# Altium project Clock_Led_7_thanh_Huynh_Tan_Cuong.PrjPcb
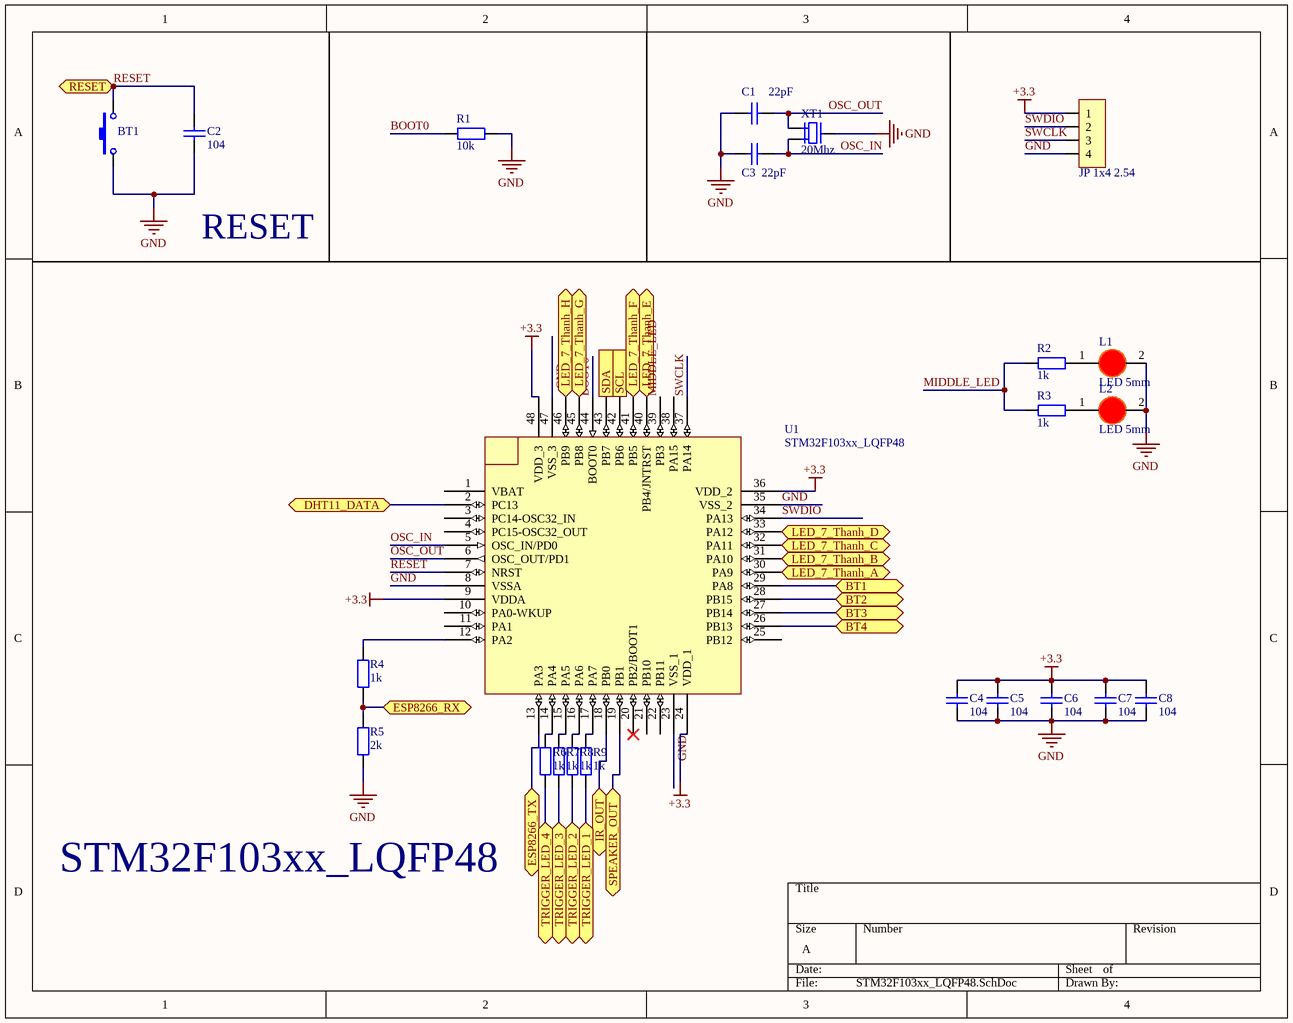
[diagram p0: STM32F103xx_LQFP48.SchDoc]
9 sheets, 77 parts. Net scope: flat (ports and power ports of the same name join across sheets).
Board file: PCB1.PcbDoc
Sheets:
  STM32F103xx_LQFP48.SchDoc
  4_LEDS_SEGMENT.SchDoc
  DS3231.SchDoc
  DHT11.SchDoc
  TSOP1838.SchDoc
  ESP8266_Module.SchDoc
  POWER_12_5_33.SchDoc
  BUZZER_RELAY.SchDoc
  BUTTONS.SchDoc

## Sheet STM32F103xx_LQFP48.SchDoc
size A; SheetNumber: 1; SheetTotal: 9

### Parts
BT1  Nut Nhan 2 Chan SMD 3x6x2.5  [Nut Nhan 2 Chan SMD 3x6x2.5]  (value not drawn)
C1  22pF  [tu 0603]
C2  104  [tu 0603]
C3  22pF  [tu 0603]
C4  104  [tu 0603]
C5  104  [tu 0603]
C6  104  [tu 0603]
C7  104  [tu 0603]
C8  104  [tu 0603]
JP1  JP 1x4 2.54  [JP 1x4 DC]
L1  LED 5mm  [LED-5MM-RED]
L2  LED 5mm  [LED-5MM-RED]
R1  10k  [tro smd 0603]
R2  1k  [tro smd 0603]
R3  1k  [tro smd 0603]
R4  1k  [tro smd 0603]
R5  2k  [tro smd 0603]
R6  1k  [tro smd 0603]
R7  1k  [tro smd 0603]
R8  1k  [tro smd 0603]
R9  1k  [tro smd 0603]
U1  STM32F103xx_LQFP48  [STM32_LQPF48]
XT1  20Mhz  [Thach Anh 3 Chan SMD]

### Ports
BT1 (bidir), BT2 (bidir), BT3 (bidir), BT4 (bidir), DHT11_DATA (bidir), ESP8266_RX (bidir), ESP8266_TX (bidir), IR_OUT (bidir), LED_7_Thanh_A (bidir), LED_7_Thanh_B (bidir), LED_7_Thanh_C (bidir), LED_7_Thanh_D (bidir), LED_7_Thanh_E (bidir), LED_7_Thanh_F (bidir), LED_7_Thanh_G (bidir), LED_7_Thanh_H (bidir), RESET (bidir), SCL, SDA, SPEAKER_OUT (bidir), TRIGGER_LED_1 (bidir), TRIGGER_LED_2 (bidir), TRIGGER_LED_3 (bidir), TRIGGER_LED_4 (bidir)

### Nets
+3.3: C4.1 C5.1 C6.1 C7.1 C8.1 JP1.1 U1.9(VDDA) U1.24(VDD_1) U1.36(VDD_2) U1.48(VDD_3)
GND: BT1.1 C1.2 C2.2 C3.2 C4.2 C5.2 C6.2 C7.2 C8.2 JP1.4 L1.2(K) L2.2(K) R1.2 R5.1 U1.8(VSSA) U1.23(VSS_1) U1.35(VSS_2) U1.47(VSS_3) XT1.2
BOOT0: R1.1 U1.44(BOOT0)
LED_7_Thanh_A: U1.30(PA9) ; port LED_7_Thanh_A
LED_7_Thanh_B: U1.31(PA10) ; port LED_7_Thanh_B
LED_7_Thanh_C: U1.32(PA11) ; port LED_7_Thanh_C
LED_7_Thanh_D: U1.33(PA12) ; port LED_7_Thanh_D
LED_7_Thanh_E: U1.40(PB4/JNTRST) ; port LED_7_Thanh_E
LED_7_Thanh_F: U1.41(PB5) ; port LED_7_Thanh_F
LED_7_Thanh_G: U1.45(PB8) ; port LED_7_Thanh_G
LED_7_Thanh_H: U1.46(PB9) ; port LED_7_Thanh_H
MIDDLE_LED: R2.1 R3.1 U1.39(PB3)
OSC_IN: C3.1 U1.5(OSC_IN/PD0) XT1.3
OSC_OUT: C1.1 U1.6(OSC_OUT/PD1) XT1.1
RESET: BT1.2 C2.1 U1.7(NRST) ; port RESET
SWCLK: JP1.3 U1.37(PA14)
SWDIO: JP1.2 U1.34(PA13)
Net1_OUT: U1.18(PB0) ; port IR_OUT
NetBT3_1: U1.29(PA8) ; port BT1
NetBT4_1: U1.28(PB15) ; port BT2
NetBT5_1: U1.27(PB14) ; port BT3
NetBT6_1: U1.26(PB13) ; port BT4
NetL1_1: L1.1(A) R2.2
NetL2_1: L2.1(A) R3.2
NetMD1_1: R4.1 R5.2 ; port ESP8266_RX
NetMD1_8: U1.13(PA3) ; port ESP8266_TX
NetP1_2: U1.2(PC13) ; port DHT11_DATA
NetP2_2: U1.19(PB1) ; port SPEAKER_OUT
NetR4_2: R4.2 U1.12(PA2)
NetR6_1: R6.1 U1.14(PA4)
NetR6_2: R6.2 ; port TRIGGER_LED_4
NetR7_1: R7.1 U1.15(PA5)
NetR7_2: R7.2 ; port TRIGGER_LED_3
NetR8_1: R8.1 U1.16(PA6)
NetR8_2: R8.2 ; port TRIGGER_LED_2
NetR9_1: R9.1 U1.17(PA7)
NetR9_2: R9.2 ; port TRIGGER_LED_1
NetR19_1: U1.42(PB6) ; port SCL
NetR20_1: U1.43(PB7) ; port SDA

Not connected (* = marked no-connect by the designer): U1 1(VBAT) 3(PC14-OSC32_IN) 4(PC15-OSC32_OUT) 10(PA0-WKUP) 11(PA1) 20(PB2/BOOT1)* 21(PB10) 22(PB11) 25(PB12) 38(PA15)

### Notes on the sheet
- RESET
- STM32F103xx_LQFP48

### Library data of the parts
BT1 = Nut Nhan 2 Chan SMD 3x6x2.5: Ma_Hang: MH001036; Ten: Nút Nhấn 2 Chân 3x6x2.5MM SMD
C1 C3 = Tu 0603 22pF 50V 10%: Dán; Don_Vi: Con; So_Chan: 2; Ten_Linh_Kien: Tụ 0603 22pF 50V 10%; Ma_Hang: MH004570; Chung_Loai: Dán; Kieu_Chan: *
C2 C4-C8 = Tu 0603 104 50V 10%: Dán; Don_Vi: Con; So_Chan: 2; Ten_Linh_Kien: Tụ 0603 104-100nF 10% 50V; Ma_Hang: MH004568; Chung_Loai: Dán; Kieu_Chan: *
JP1 = JP 1x4 2.54 Duc Cong: Cắm; Ten_Linh_Kien: Jump Đơn Đực 2.54MM 1x40P Cong Đứng; Don_Vi: Con; Ma_Hang: MH000904; Ghi_Chu: *; Kieu_Chan: *; Chung_Loai: Cắm
L1 L2 = LED 5mm Do: Cắm; Don_Vi: Con; Ma_Hang: MH008967; Ten_Linh_Kien: Led 5MM Phủ Đỏ (1000c); Ghi_Chu: *; Kieu_Chan: *; Chung_Loai: Cắm
R1 = Tro 0603 1% 10k: Dán; Don_Vi: Con; So_Chan: 2; Ten_Linh_Kien: Trở 0603 1% 10k; Ma_Hang: MH006333; Chung_Loai: Dán; Kieu_Chan: *
R2-R4 R6-R9 = Tro 0603 1% 1k: Dán; So_Chan: 2; Don_Vi: Con; Ten_Linh_Kien: Trở 0603 1% 1k; Ma_Hang: MH006334; Chung_Loai: Dán; Kieu_Chan: *
R5 = Tro 0603 5% 2k: Dán; Don_Vi: Con; So_Chan: 2; Ten_Linh_Kien: Trở 0603 5% 2k; Ma_Hang: MH006324; Chung_Loai: Dán; Kieu_Chan: *
XT1 = Thach anh 3 Chan SMD: Crystal For all Crystal 2pin.; Value: 4Mhz
U1 = STM32F103xx_LQFP48: Published: 30-May-2008; DatasheetVersion: rev6, Mar-2008; PackageVersion: Mar-2008; PackageReference: LQFP48; Publisher: Altium Limited; PackageDescription: 48-Pin Low-Profile Quad Flat Pack, 7 x 7 mm Body, 0.5 mm Pitch (LQFP48); ComponentLink1Description: Manufacturer Link; ComponentLink1URL: www.st.com/stm32; ComponentLink2Description: Datasheet; ComponentLink2URL: http://www.st.com/stonline/products/literature/ds/13587.pdf

## Sheet 4_LEDS_SEGMENT.SchDoc
size A; SheetNumber: 2; SheetTotal: 9
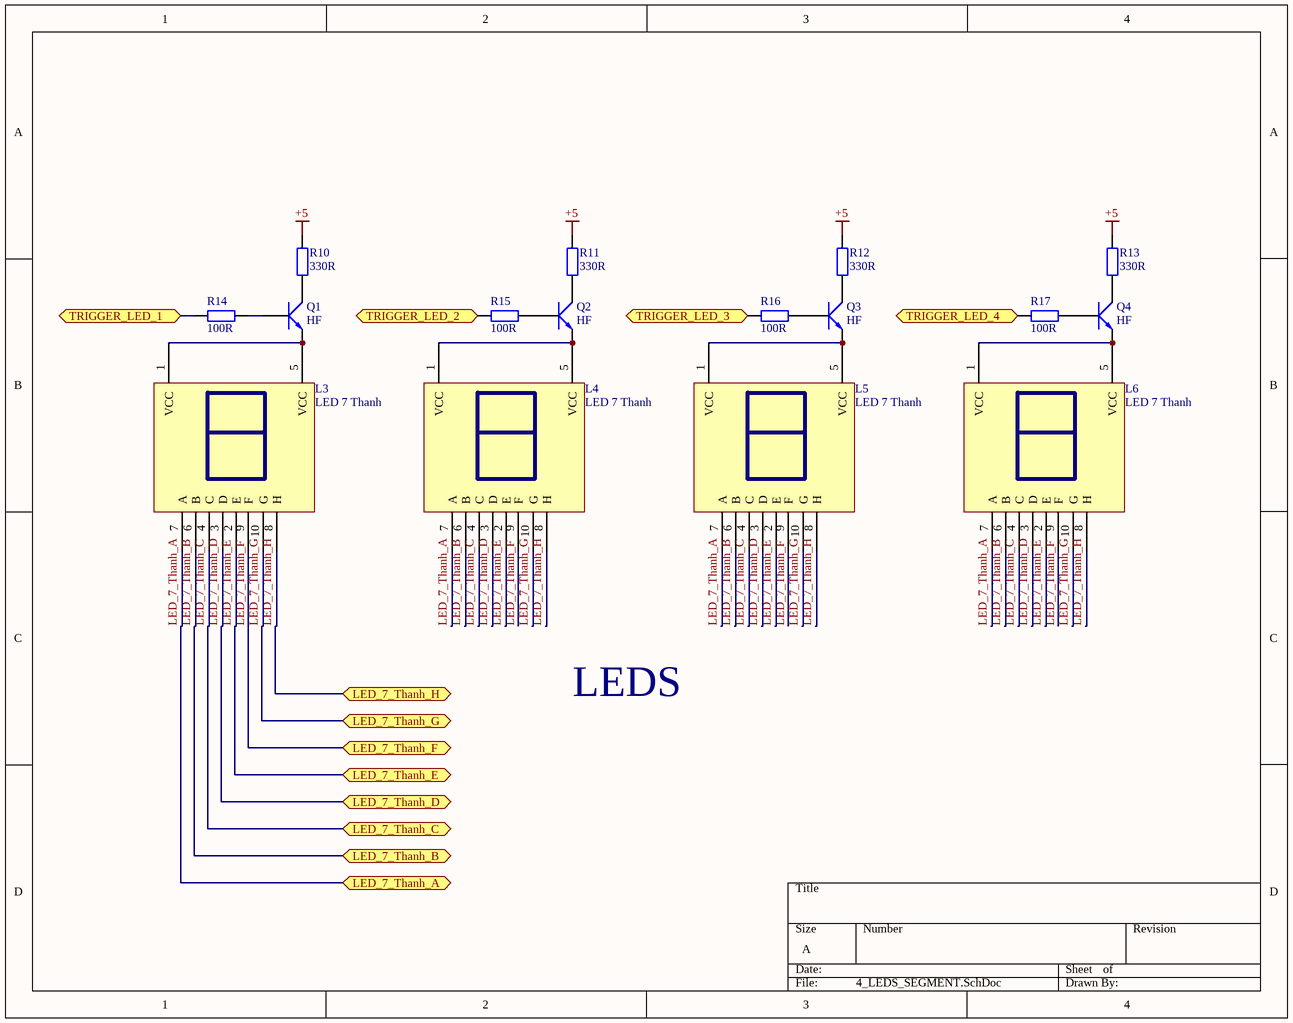
[diagram p1: 4_LEDS_SEGMENT.SchDoc]

### Parts
L3  LED 7 Thanh  [LED7SEG_2.3inch]
L4  LED 7 Thanh  [LED7SEG_2.3inch]
L5  LED 7 Thanh  [LED7SEG_2.3inch]
L6  LED 7 Thanh  [LED7SEG_2.3inch]
Q1  HF  [SOT23]
Q2  HF  [SOT23]
Q3  HF  [SOT23]
Q4  HF  [SOT23]
R10  330R  [tro smd 0603]
R11  330R  [tro smd 0603]
R12  330R  [tro smd 0603]
R13  330R  [tro smd 0603]
R14  100R  [tro smd 0603]
R15  100R  [tro smd 0603]
R16  100R  [tro smd 0603]
R17  100R  [tro smd 0603]

### Ports
LED_7_Thanh_A (bidir), LED_7_Thanh_B (bidir), LED_7_Thanh_C (bidir), LED_7_Thanh_D (bidir), LED_7_Thanh_E (bidir), LED_7_Thanh_F (bidir), LED_7_Thanh_G (bidir), LED_7_Thanh_H (bidir), TRIGGER_LED_1 (bidir), TRIGGER_LED_2 (bidir), TRIGGER_LED_3 (bidir), TRIGGER_LED_4 (bidir)

### Nets
+5: R10.2 R11.2 R12.2 R13.2
LED_7_Thanh_A: L3.7(A) L4.7(A) L5.7(A) L6.7(A) ; port LED_7_Thanh_A
LED_7_Thanh_B: L3.6(B) L4.6(B) L5.6(B) L6.6(B) ; port LED_7_Thanh_B
LED_7_Thanh_C: L3.4(C) L4.4(C) L5.4(C) L6.4(C) ; port LED_7_Thanh_C
LED_7_Thanh_D: L3.3(D) L4.3(D) L5.3(D) L6.3(D) ; port LED_7_Thanh_D
LED_7_Thanh_E: L3.2(E) L4.2(E) L5.2(E) L6.2(E) ; port LED_7_Thanh_E
LED_7_Thanh_F: L3.9(F) L4.9(F) L5.9(F) L6.9(F) ; port LED_7_Thanh_F
LED_7_Thanh_G: L3.10(G) L4.10(G) L5.10(G) L6.10(G) ; port LED_7_Thanh_G
LED_7_Thanh_H: L3.8(H) L4.8(H) L5.8(H) L6.8(H) ; port LED_7_Thanh_H
NetL3_1: L3.1(VCC) L3.5(VCC) Q1.2(E)
NetL4_1: L4.1(VCC) L4.5(VCC) Q2.2(E)
NetL5_1: L5.1(VCC) L5.5(VCC) Q3.2(E)
NetL6_1: L6.1(VCC) L6.5(VCC) Q4.2(E)
NetQ1_1: Q1.1(B) R14.2
NetQ1_3: Q1.3(C) R10.1
NetQ2_1: Q2.1(B) R15.2
NetQ2_3: Q2.3(C) R11.1
NetQ3_1: Q3.1(B) R16.2
NetQ3_3: Q3.3(C) R12.1
NetQ4_1: Q4.1(B) R17.2
NetQ4_3: Q4.3(C) R13.1
NetR6_2: R17.1 ; port TRIGGER_LED_4
NetR7_2: R16.1 ; port TRIGGER_LED_3
NetR8_2: R15.1 ; port TRIGGER_LED_2
NetR9_2: R14.1 ; port TRIGGER_LED_1

### Notes on the sheet
- LEDS

### Library data of the parts
L3-L6 = LED 7x1 2.3inch Anot: Dán; Don_Vi: Con; Ma_Hang: MH000901; Ten_Linh_Kien: Led 7 2.3 1 Số Anot (Sáng Đỏ); Ghi_Chu: *; Kieu_Chan: *; Chung_Loai: Dán
Q1-Q4 = C1815 HF SMD: NPN transistor; Value: C9014
R10-R13 = Tro 0603 5% 330R: Dán; Don_Vi: Con; Ma_Hang: MH006910; So_Chan: 2; Ten_Linh_Kien: Trở 0603 5% 330R; Chung_Loai: Dán; Kieu_Chan: *
R14-R17 = Tro 0603 5% 100R: Dán; Don_Vi: Con; So_Chan: 2; Ten_Linh_Kien: Trở 0603 5% 100R; Ma_Hang: MH006315; Chung_Loai: Dán; Kieu_Chan: *

## Sheet DS3231.SchDoc
size A; SheetNumber: 3; SheetTotal: 9
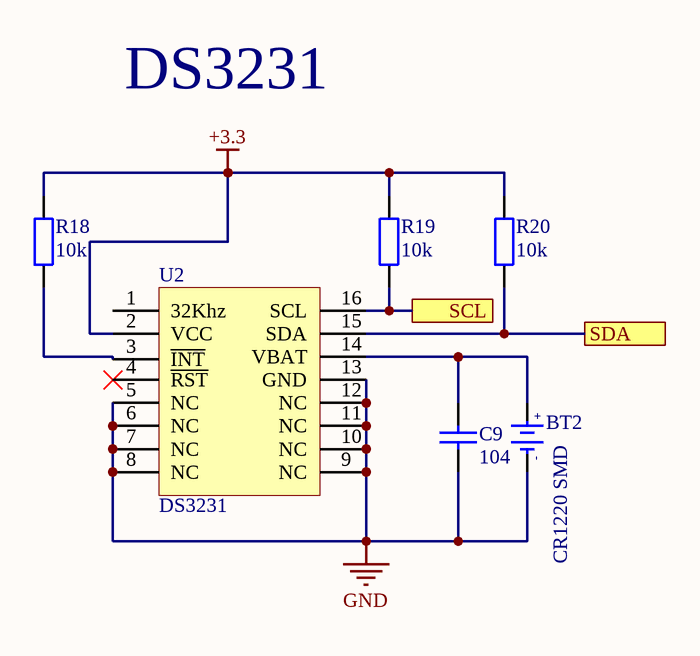
[diagram p2: DS3231.SchDoc]

### Parts
BT2  CR1220 SMD  [DE PIN CR1220]
C9  104  [tu 0603]
R18  10k  [tro smd 0603]
R19  10k  [tro smd 0603]
R20  10k  [tro smd 0603]
U2  DS3231  [SOIC 16]

### Ports
SCL, SDA

### Nets
+3.3: R18.2 R19.2 R20.2 U2.2(VCC)
GND: BT2.2(GND) C9.2 U2.5(NC) U2.6(NC) U2.7(NC) U2.8(NC) U2.9(NC) U2.10(NC) U2.11(NC) U2.12(NC) U2.13(GND)
NetBT2_1: BT2.1(+3V) C9.1 U2.14(VBAT)
NetR18_1: R18.1 U2.3(~{INT})
NetR19_1: R19.1 U2.16(SCL) ; port SCL
NetR20_1: R20.1 U2.15(SDA) ; port SDA

Not connected (* = marked no-connect by the designer): U2 1(32Khz) 4(~{RST})*

### Notes on the sheet
- DS3231
- (in symbol De pin CR1220 SMD) +; -

### Library data of the parts
BT2 = De pin CR1220 SMD: Ten: Đế PIN CR1220 SMD; Ma_Hang: MH000833
C9 = Tu 0603 104 50V 10%: as C2 on sheet STM32F103xx_LQFP48; Chung_Loai: Dán; Kieu_Chan: *
R18-R20 = Tro 0603 1% 10k: as R1 on sheet STM32F103xx_LQFP48; Chung_Loai: Dán; Kieu_Chan: *
U2 = DS3231 SMD: SOIC

## Sheet DHT11.SchDoc
size A; SheetNumber: 4; SheetTotal: 9
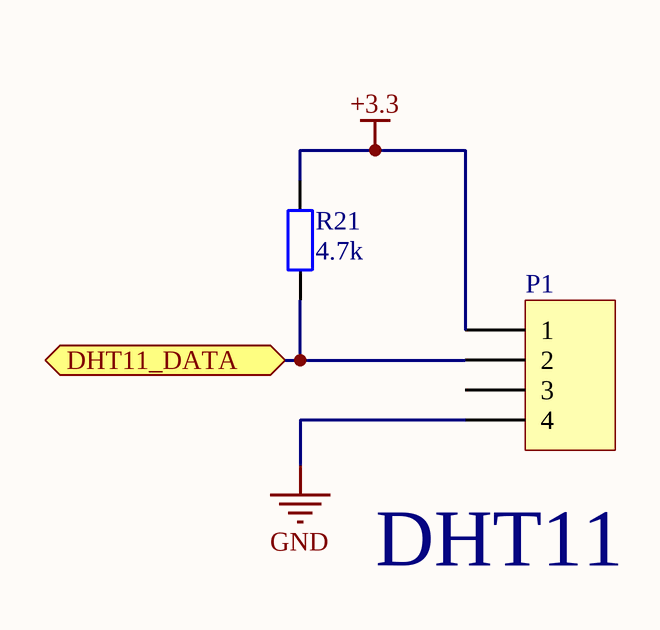
[diagram p3: DHT11.SchDoc]

### Parts
P1  DHT11  [HDR1X4H]
R21  4.7k  [tro smd 0603]

### Ports
DHT11_DATA (bidir)

### Nets
+3.3: P1.1 R21.2
GND: P1.4
NetP1_2: P1.2 R21.1 ; port DHT11_DATA

Not connected (* = marked no-connect by the designer): P1 3

### Library data of the parts
P1 = Header 4H: Header, 4-Pin, Right Angle; LatestRevisionDate: 17-Jul-2002; LatestRevisionNote: Re-released for DXP Platform.; Publisher: Altium Limited
R21 = Tro 0603 5% 4.7k: Dán; Don_Vi: Con; So_Chan: 2; Ten_Linh_Kien: Trở 0603 5% 4.7k; Ma_Hang: MH006327; Chung_Loai: Dán; Kieu_Chan: *

## Sheet TSOP1838.SchDoc
size A; SheetNumber: 5; SheetTotal: 9
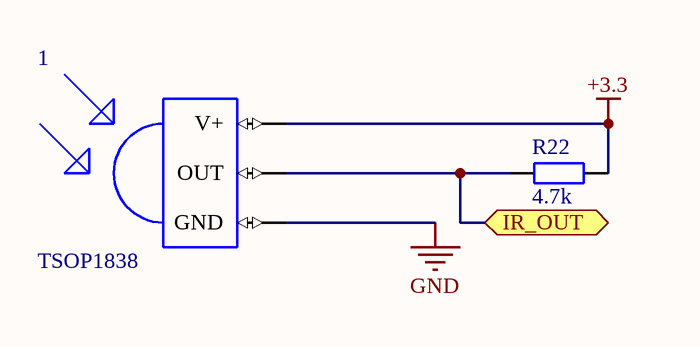
[diagram p4: TSOP1838.SchDoc]

### Parts
1  TSOP1838  [TSOP18XX]
R22  4.7k  [tro smd 0603]

### Ports
IR_OUT (bidir)

### Nets
+3.3: 1.VCC(V+) R22.2
GND: 1.GND
Net1_OUT: 1.OUT R22.1 ; port IR_OUT

### Library data of the parts
1 = TSOP1838: IR Remote Receiver 38KHz 35m 3-Pin; MF: Vishay; Price: None; SnapEDA_Link: https://www.snapeda.com/parts/TSOP1838/Vishay/view-part/561684/?ref=snap; Availability: Unavailable; Value: *; MP: TSOP1838; Package: None
R22 = Tro 0603 5% 4.7k: as R21 on sheet DHT11; Chung_Loai: Dán; Kieu_Chan: *

## Sheet ESP8266_Module.SchDoc
size A; SheetNumber: 6; SheetTotal: 9
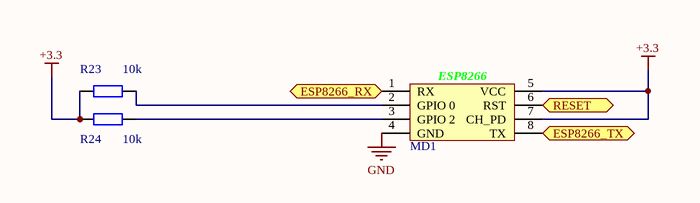
[diagram p5: ESP8266_Module.SchDoc]

### Parts
MD1  ESP8266 Module  [ESP2866 Module]  (value not drawn)
R23  10k  [tro smd 0603]
R24  10k  [tro smd 0603]

### Ports
ESP8266_RX (bidir), ESP8266_TX (bidir), RESET (bidir)

### Nets
+3.3: MD1.5(VCC) MD1.7(CH_PD) R23.1 R24.1
GND: MD1.4(GND)
RESET: MD1.6(RST) ; port RESET
NetMD1_1: MD1.1(RX) ; port ESP8266_RX
NetMD1_2: MD1.2(GPIO_0) R23.2
NetMD1_3: MD1.3(GPIO_2) R24.2
NetMD1_8: MD1.8(TX) ; port ESP8266_TX

### Notes on the sheet
- (in symbol ESP8266 Module) ESP8266

### Library data of the parts
R23 R24 = Tro 0603 1% 10k: as R1 on sheet STM32F103xx_LQFP48; Chung_Loai: Dán; Kieu_Chan: *

## Sheet POWER_12_5_33.SchDoc
size A; SheetNumber: 7; SheetTotal: 9
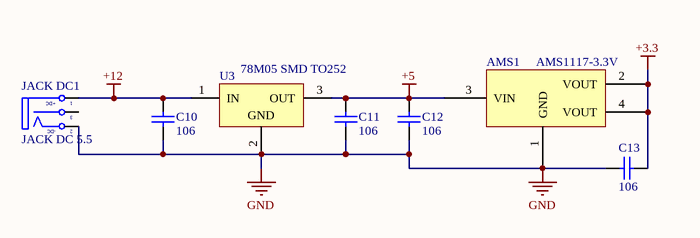
[diagram p6: POWER_12_5_33.SchDoc]

### Parts
AMS1  AMS1117-3.3V  [SOT223]
C10  106  [tu 0603]
C11  106  [tu 0603]
C12  106  [tu 0603]
C13  106  [tu 0603]
JACK_DC1  JACK DC 5.5  [JACK DC 5.5]
U3  78M05 SMD TO252  [TO252]

### Nets
+3.3: AMS1.2(VOUT) AMS1.4(VOUT) C13.2
+5: AMS1.3(VIN) C11.1 C12.2 U3.3(OUT)
+12: C10.1 JACK_DC1.1(T) U3.1(IN)
GND: AMS1.1(GND) C10.2 C11.2 C12.1 C13.1 JACK_DC1.2(TN) U3.2(GND)

Not connected (* = marked no-connect by the designer): JACK_DC1 3(S)

### Notes on the sheet
- (in symbol JACK DC 5.5) +DC; -DC

### Library data of the parts
AMS1 = AMS1117 SMD: Dán; Value: AMS1117-3.3V SOT223; Don_Vi: Con; Ma_Hang: MH000596; Ghi_Chu: *; Kieu_Chan: *; Chung_Loai: Dán
C10-C13 = Tu 0603 106 16V 20%: Dán; Don_Vi: Con; So_Chan: 2; Ten_Linh_Kien: Tụ 0603-10uF 20% 16V; Ma_Hang: MH004848; Chung_Loai: Dán; Kieu_Chan: *
JACK_DC1 = JACK DC 5.5: Value: Jac DC
U3 = 78M05 SMD TO252: Dán; Don_Vi: Con; Ten_Linh_Kien: 78M05 TO252; Ma_Hang: MH001917; Ghi_Chu: *; Kieu_Chan: *; Chung_Loai: Dán

## Sheet BUZZER_RELAY.SchDoc
size A; SheetNumber: 8; SheetTotal: 9
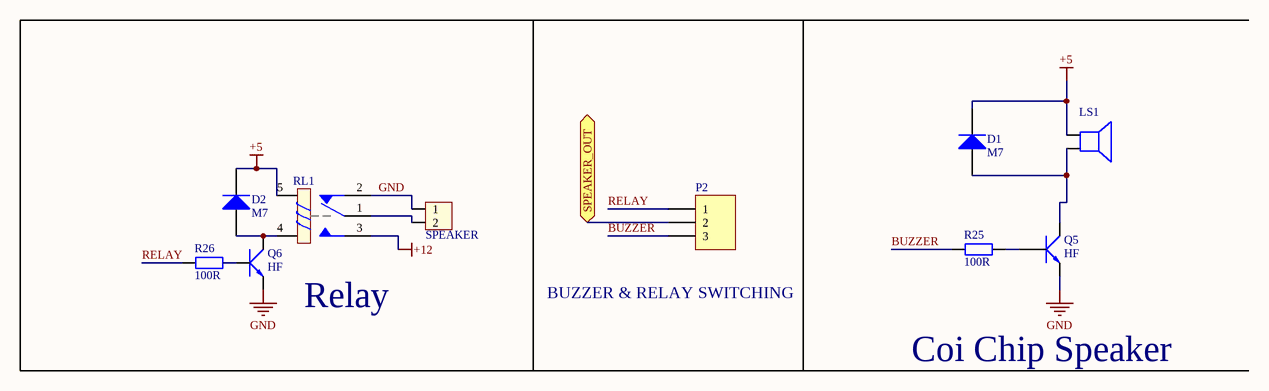
[diagram p7: BUZZER_RELAY.SchDoc]

### Parts
D1  M7  [DIODE SMA]
D2  M7  [DIODE SMA]
H1  SPEAKER  [XH2.54M-2]
LS1  Coi Chip Speaker  [Coi Chip Speacker]
P2  BUZZER & RELAY SWITCHING  [HDR1X3]
Q5  HF  [SOT23]
Q6  HF  [SOT23]
R25  100R  [tro smd 0603]
R26  100R  [tro smd 0603]
RL1  Relay  [Relay 5 Chan SRD]

### Ports
SPEAKER_OUT (bidir)

### Nets
+5: D1.2(K) D2.2(K) LS1.1 RL1.5
+12: RL1.3
GND: H1.1 Q5.2(E) Q6.2(E) RL1.2
BUZZER: P2.3 R25.1
RELAY: P2.1 R26.1
NetD1_1: D1.1(A) LS1.2 Q5.3(C)
NetD2_1: D2.1(A) Q6.3(C) RL1.4
NetH1_2: H1.2 RL1.1
NetP2_2: P2.2 ; port SPEAKER_OUT
NetQ5_1: Q5.1(B) R25.2
NetQ6_1: Q6.1(B) R26.2

### Library data of the parts
D1 D2 = Diode M7 ( 4007 ): Dán; Don_Vi: Con; Ten_Linh_Kien: Diode M7 1N4007 SMD 1A 1000V; Ma_Hang: MH000944; Chung_Loai: Dán; Ghi_Chu: *
H1 = Header 2P 2.54 Duc Thang: Cắm; Ten_Linh_Kien: Header 2P XH2.54-2P Đực Thẳng; Don_Vi: Con; Ma_Hang: MH001283; Chung_Loai: Cắm
LS1 = Coi Chip Speaker: Còi chip
P2 = Header 3: Header, 3-Pin; LatestRevisionDate: 17-Jul-2002; LatestRevisionNote: Re-released for DXP Platform.; Publisher: Altium Limited
Q5 Q6 = C1815 HF SMD: NPN transistor; Value: C9014
R25 R26 = Tro 0603 5% 100R: as R14 on sheet 4_LEDS_SEGMENT; Chung_Loai: Dán; Kieu_Chan: *
RL1 = Relay 5 Chan SRD: Relay 5 Chan; Ma_Hang: MH009374; Ten: Relay 5V10A SRD-05VDC-SL-C Chính Hãng

## Sheet BUTTONS.SchDoc
size A; SheetNumber: 9; SheetTotal: 9
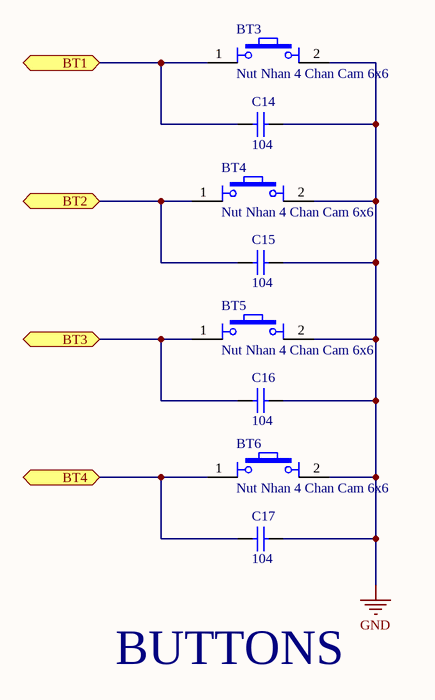
[diagram p8: BUTTONS.SchDoc]

### Parts
BT3  Nut Nhan 4 Chan Cam 6x6  [Nut Nhan 4 Chan Cam 6x6]
BT4  Nut Nhan 4 Chan Cam 6x6  [Nut Nhan 4 Chan Cam 6x6]
BT5  Nut Nhan 4 Chan Cam 6x6  [Nut Nhan 4 Chan Cam 6x6]
BT6  Nut Nhan 4 Chan Cam 6x6  [Nut Nhan 4 Chan Cam 6x6]
C14  104  [tu 0603]
C15  104  [tu 0603]
C16  104  [tu 0603]
C17  104  [tu 0603]

### Ports
BT1 (bidir), BT2 (bidir), BT3 (bidir), BT4 (bidir)

### Nets
GND: BT3.2 BT4.2 BT5.2 BT6.2 C14.2 C15.2 C16.2 C17.2
NetBT3_1: BT3.1 C14.1 ; port BT1
NetBT4_1: BT4.1 C15.1 ; port BT2
NetBT5_1: BT5.1 C16.1 ; port BT3
NetBT6_1: BT6.1 C17.1 ; port BT4

### Notes on the sheet
- BUTTONS

### Library data of the parts
BT3-BT6 = Nut Nhan 4 Chan Cam 6x6: Nut Nhan 4 Chan 6x6mm; Ten: Nút Nhấn 4 Chân 6x6x5MM DIP; Ma_Hang: MH004584
C14-C17 = Tu 0603 104 50V 10%: as C2 on sheet STM32F103xx_LQFP48; Chung_Loai: Dán; Kieu_Chan: *

## Nets that join several sheets
+3.3: STM32F103xx_LQFP48 (10 pins), DS3231 (R18.2 R19.2 R20.2 U2.2), DHT11 (P1.1 R21.2), TSOP1838 (1.VCC R22.2), ESP8266_Module (MD1.5 MD1.7 R23.1 R24.1), POWER_12_5_33 (AMS1.2 AMS1.4 C13.2)
+5: 4_LEDS_SEGMENT (R10.2 R11.2 R12.2 R13.2), POWER_12_5_33 (AMS1.3 C11.1 C12.2 U3.3), BUZZER_RELAY (D1.2 D2.2 LS1.1 RL1.5)
+12: POWER_12_5_33 (C10.1 JACK_DC1.1 U3.1), BUZZER_RELAY (RL1.3)
GND: STM32F103xx_LQFP48 (19 pins), DS3231 (11 pins), DHT11 (P1.4), TSOP1838 (1.GND), ESP8266_Module (MD1.4), POWER_12_5_33 (7 pins), BUZZER_RELAY (H1.1 Q5.2 Q6.2 RL1.2), BUTTONS (8 pins)
LED_7_Thanh_A: STM32F103xx_LQFP48 (U1.30), 4_LEDS_SEGMENT (L3.7 L4.7 L5.7 L6.7)
LED_7_Thanh_B: STM32F103xx_LQFP48 (U1.31), 4_LEDS_SEGMENT (L3.6 L4.6 L5.6 L6.6)
LED_7_Thanh_C: STM32F103xx_LQFP48 (U1.32), 4_LEDS_SEGMENT (L3.4 L4.4 L5.4 L6.4)
LED_7_Thanh_D: STM32F103xx_LQFP48 (U1.33), 4_LEDS_SEGMENT (L3.3 L4.3 L5.3 L6.3)
LED_7_Thanh_E: STM32F103xx_LQFP48 (U1.40), 4_LEDS_SEGMENT (L3.2 L4.2 L5.2 L6.2)
LED_7_Thanh_F: STM32F103xx_LQFP48 (U1.41), 4_LEDS_SEGMENT (L3.9 L4.9 L5.9 L6.9)
LED_7_Thanh_G: STM32F103xx_LQFP48 (U1.45), 4_LEDS_SEGMENT (L3.10 L4.10 L5.10 L6.10)
LED_7_Thanh_H: STM32F103xx_LQFP48 (U1.46), 4_LEDS_SEGMENT (L3.8 L4.8 L5.8 L6.8)
Net1_OUT: STM32F103xx_LQFP48 (U1.18), TSOP1838 (1.OUT R22.1)
NetBT3_1: STM32F103xx_LQFP48 (U1.29), BUTTONS (BT3.1 C14.1)
NetBT4_1: STM32F103xx_LQFP48 (U1.28), BUTTONS (BT4.1 C15.1)
NetBT5_1: STM32F103xx_LQFP48 (U1.27), BUTTONS (BT5.1 C16.1)
NetBT6_1: STM32F103xx_LQFP48 (U1.26), BUTTONS (BT6.1 C17.1)
NetMD1_1: STM32F103xx_LQFP48 (R4.1 R5.2), ESP8266_Module (MD1.1)
NetMD1_8: STM32F103xx_LQFP48 (U1.13), ESP8266_Module (MD1.8)
NetP1_2: STM32F103xx_LQFP48 (U1.2), DHT11 (P1.2 R21.1)
NetP2_2: STM32F103xx_LQFP48 (U1.19), BUZZER_RELAY (P2.2)
NetR6_2: STM32F103xx_LQFP48 (R6.2), 4_LEDS_SEGMENT (R17.1)
NetR7_2: STM32F103xx_LQFP48 (R7.2), 4_LEDS_SEGMENT (R16.1)
NetR8_2: STM32F103xx_LQFP48 (R8.2), 4_LEDS_SEGMENT (R15.1)
NetR9_2: STM32F103xx_LQFP48 (R9.2), 4_LEDS_SEGMENT (R14.1)
NetR19_1: STM32F103xx_LQFP48 (U1.42), DS3231 (R19.1 U2.16)
NetR20_1: STM32F103xx_LQFP48 (U1.43), DS3231 (R20.1 U2.15)
RESET: STM32F103xx_LQFP48 (BT1.2 C2.1 U1.7), ESP8266_Module (MD1.6)